# EasyEDA Pro project AFG_Health_Theremin.epro

# Schematic ProPrj_Frequency Generator for Healing_2025-11-21
Board Name: ProPrj_Frequency Generator for Healing_2025-11-21; Create Date: 2025-11-25; Page Name: ProPrj_Frequency Generator for Healing_2025-11-21; Project Name: Frequency Generator for Healing; Schematic Name: ProPrj_Frequency Generator for Healing_2025-11-21; Update Date: 2025-12-27; File: ProPrj_Frequency Generator for Healing_2025-11-21; Id: /; Sheet: /
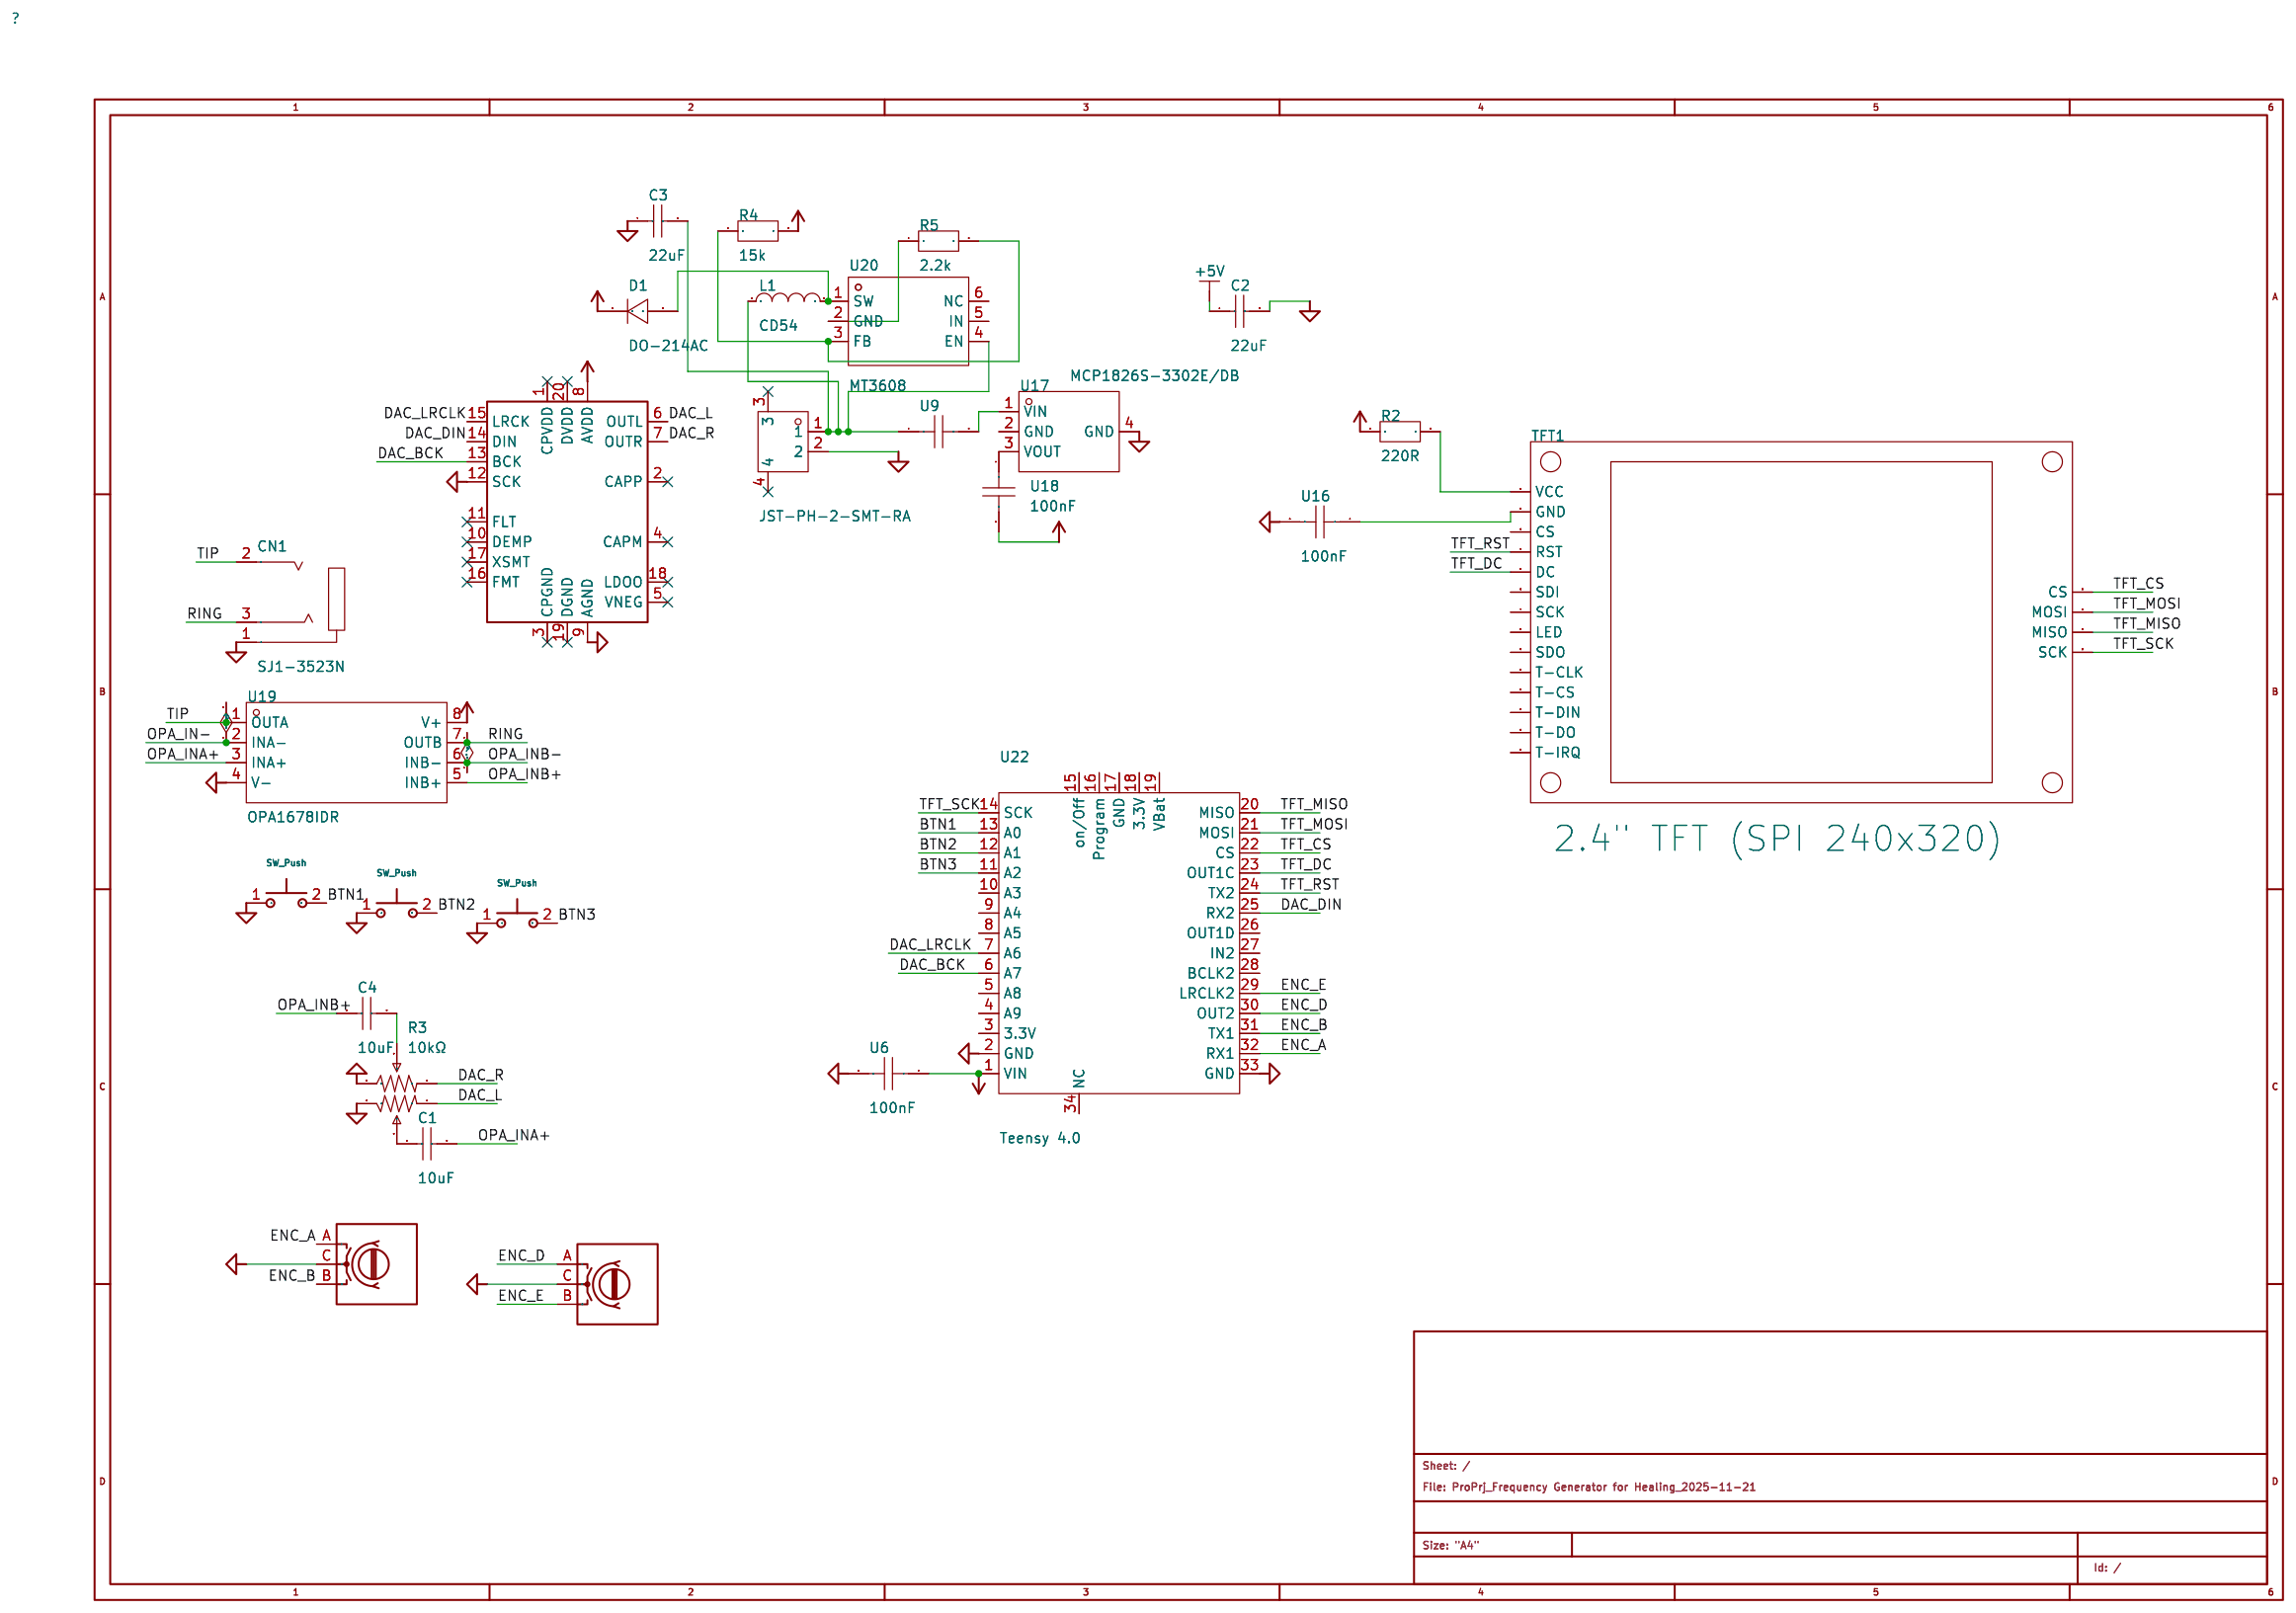
[diagram p0: schematic sheet]

## Parts
C1  10uF  [C1206]
C2  22uF  [C1206]
C3  22uF  [C1206]
C4  10uF  [C1206]
CN1  SJ1-3523N  [AUDIO-TH_SJ1-3523N]
CN2  JST-PH-2-SMT-RA  [CONN-SMD_JST-PH-2-SMT-RA]
D1  DO-214AC  [SMA_L4.3-W2.6-LS5.2-RD]
L1  CD54  [IND-SMD_L5.8-W5.2_CD54-4R7MT]
R2  220R  [R0603]
R3  10kΩ  [RES-ADJ-TH_RK097221005C]
R4  15k  [R0603]
R5  2.2k  [R0603]
SW1  EC110104S2A-VA1-006  [EC11-TH_EC110104S2A-VA1-006]
SW2  SW_Push  [SW-TH_4P-L7.2-W7.2-P4.50-S6.5_TC-02]
SW3  SW_Push  [SW-TH_4P-L7.2-W7.2-P4.50-S6.5_TC-02]
SW4  SW_Push  [SW-TH_4P-L7.2-W7.2-P4.50-S6.5_TC-02]
SW5  EC110104S2A-VA1-006  [EC11-TH_EC110104S2A-VA1-006]
TFT1  2.4" TFT (SPI 240x320)  [2.4_TFT_SPI_240x320]
U1  PCM5102APWR  [TSSOP-20_L6.5-W4.4-P0.65-LS6.4-BL]
U6  100nF  [C0603]
U9  C0603  [C0603]
U16  100nF  [C0603]
U17  MCP1826S-3302E/DB  [SOT-223-3_L6.7-W3.7-P2.30-LS7.0-BR]
U18  100nF  [C0603]
U19  OPA1678IDR  [SOIC-8_L5.0-W4.0-P1.27-LS6.0-BL]
U20  MT3608  [SOT-23-6_L2.9-W1.6-P0.95-LS2.8-BL]
U22  Teensy 4.0  [COMM-TH_34P-L35.6-W17.8-P2.54_C9900133251]

## Library data of the parts
C1-C4 = CL31A107MQHNNNE: Capacitance:100uF Tolerance:±20% Tolerance:±20% Voltage Rating:6.3V Temperature Coefficient:X5R; LCSC Part Name: 100uF ±20% 6.3V; Supplier Part: C15008; Manufacturer: SAMSUNG(三星); Supplier Footprint: 1206; JLCPCB Part Class: Basic Part; Datasheet: https://item.szlcsc.com/datasheet/CL31A107MQHNNNE/15681.html; Supplier: LCSC; Tolerance: ±20%; Voltage Rating: 6.3V; Temperature Coefficient: X5R
CN1 = SJ1-3523N: Supplier Part: C20182914; Manufacturer: CUI; JLCPCB Part Class: Extended Part; Datasheet: https://item.szlcsc.com/datasheet/SJ1-3523N/21508910.html; Supplier: LCSC
CN2 = JST-PH-2-SMT-RA: Supplier Part: C9900144926; Supplier Footprint: SMD; Supplier: LCSC
D1 = DO-214AC: Supplier Part: C9900026895; Supplier Footprint: SMA; JLCPCB Part Class: Extended Part; Supplier: LCSC
L1 = CD54: Supplier Part: C9900016766; JLCPCB Part Class: Extended Part; Supplier: LCSC
R2 R4 R5 = 1k: Supplier Part: C9900012840; JLCPCB Part Class: Extended Part; Supplier: LCSC
R3 = RK097221005C_1: Resistance:10kΩ Tolerance:±20% Tolerance:±20% Voltage Rating:- Power(Watts):- Number of Turns:-; LCSC Part Name: 10kΩ ±20%; Supplier Part: C470738; Manufacturer: ALPSALPINE(阿尔卑斯阿尔派); Manufacturer Part: RK097221005C; Supplier Footprint: 插件; Datasheet: https://atta.szlcsc.com/upload/public/pdf/source/20191216/C470759_F66FBF10924BEA4EB5A6234955541DDE.pdf; Supplier: LCSC; Tolerance: ±20%
SW1 SW5 = EC110104S2A-VA1-006: Supplier Part: C9900140894; Supplier Footprint: 无标准封装规格 EC11; Supplier: LCSC
SW2-SW4 = Switch_SW_Push: Push button switch, generic, two pins
TFT1 = 2.4_TFT_SPI_240x320
U1 = PCM5102APWR: Interface Type:PCM Supply Voltage:1.65V~3.46V Supply Voltage:1.65V~3.46V Number of Channels:2 Resolution:24；16；32 Operating Temperature:-25℃~+85℃ Operating Temperature:-25℃~+85℃; Supplier Part: C107671; Manufacturer: TI(德州仪器); Supplier Footprint: TSSOP-20; JLCPCB Part Class: Extended Part; Datasheet: https://www.ti.com/cn/lit/gpn/pcm5102a; Supplier: LCSC; Interface Type: PCM; Supply Voltage: 1.65V~3.46V; Number of Channels: 2; Resolution: 24；16；32; Operating Temperature: -25℃~+85℃
U6 U16 U18 = CT41G-0603-2X1-50V-0.1uF-K(N): Capacitance:100nF Tolerance:±10% Tolerance:±10% Voltage Rating:50V Temperature Coefficient:-; LCSC Part Name: 100nF ±10% 50V; Supplier Part: C125205; Manufacturer: TORCH(火炬); Supplier Footprint: 0603; JLCPCB Part Class: Extended Part; Datasheet: https://item.szlcsc.com/datasheet/CT41G-0603-2X1-50V-0.1uF-K(N)/136481.html; Supplier: LCSC; Tolerance: ±10%; Voltage Rating: 50V
U9 = C0603: Supplier Part: C9900029884; JLCPCB Part Class: Extended Part; Supplier: LCSC
U17 = MCP1826S-3302E/DB: Output Type:Fixed Voltage - Supply:6V Output Voltage:3.3V Output Voltage:3.3V Output Current:1A Power Supply Rejection Ratio (PSRR):60dB@(100Hz) Voltage Dropout:400mV@(1A) standby current:220uA Features:Short Circuit Protection；Over Temperature Protection; LCSC Part Name: 1000 mA，低压、低静态电流LDO稳压器; Supplier Part: C638624; Manufacturer: MICROCHIP(美国微芯); Supplier Footprint: SOT-223-3; JLCPCB Part Class: Extended Part; Datasheet: https://item.szlcsc.com/datasheet/MCP1826S-3302E%252FDB/668418.html; Supplier: LCSC; Output Type: Fixed; Voltage - Supply: 6V; Output Voltage: 3.3V; Output Current: 1A; Power Supply Rejection Ratio (PSRR): 60dB@(100Hz); Voltage Dropout: 400mV@(1A); standby current: 220uA; Features: Short Circuit Protection；Over Temperature Protection；Over Current Protection；Under Voltage Lockout; Operating Temperature: -40℃~+125℃; Output Configuration: Positive; Number of Outputs: 1
U19 = OPA1678IDR: LCSC Part Name: OPA167x 低失真音频运算放大器; Supplier Part: C192421; Manufacturer: TI(德州仪器); Supplier Footprint: SOIC-8-150mil; JLCPCB Part Class: Extended Part; Datasheet: https://www.ti.com/cn/lit/gpn/opa1678; Supplier: LCSC
U20 = MT3608: Function:Boost Output Type:Adjustable Voltage - Supply:2V~24V Voltage - Supply:2V~24V Output Voltage:- Output Voltage:- Output Current:2A Frequency - Switching:1.2MHz Frequency - Switching:1.2MHz Operating Temperature:-40℃~+85℃ Operating Temperature:-40℃~; LCSC Part Name: 老版本 高效1.2MHz 2A升压转换器; Supplier Part: C84817; Manufacturer: 西安航天民芯; Supplier Footprint: SOT-23-6; JLCPCB Part Class: Extended Part; Datasheet: https://item.szlcsc.com/datasheet/MT3608/85988.html; Supplier: LCSC; Function: Boost; Output Type: Adjustable; Voltage - Supply: 2V~24V; Output Current: 2A; Frequency - Switching: 1.2MHz; Operating Temperature: -40℃~+85℃; Synchronous Rectifier: No; Number of Outputs: 1; Topology: Boost; Quiescent Current: 100uA；1.6mA; Switch tube (built-in/external): Built-in
U22 = Teensy 4.0: Supplier Part: C9900133251; Supplier Footprint: Through hole; JLCPCB Part Class: Extended Part; Supplier: LCSC

## Nets
+5V: C2.1
BTN1: SW2.2 U22.13(A0)
BTN2: SW3.2 U22.12(A1)
BTN3: SW4.2 U22.11(A2)
DAC_BCK: U1.13(BCK) U22.6(A7)
DAC_DIN: U1.14(DIN) U22.25(RX2)
DAC_L: R3.1 U1.6(OUTL)
DAC_LRCLK: U1.15(LRCK) U22.7(A6)
DAC_R: R3.4 U1.7(OUTR)
ENC_A: SW1.A U22.32(RX1)
ENC_B: SW1.B SW1.C SW5.C U22.31(TX1)
ENC_D: SW5.A U22.30(OUT2)
ENC_E: SW5.B U22.29(LRCLK2)
OPA_IN-: CN1.2 U19.1(OUTA) U19.2(INA-)
OPA_INA+: C1.2 U19.3(INA+)
OPA_INB+: C4.1 U19.5(INB+)
OPA_INB-: CN1.3 U19.6(INB-) U19.7(OUTB)
POWER_+5V: D1.1 R2.1 R4.2 U1.8(AVDD) U6.1 U18.2 U19.8(V+) U22.1(VIN)
POWER_GND: C2.2 C3.1 CN1.1 CN2.2 R3.3 R3.6 SW2.1 SW3.1 SW4.1 U1.9(AGND) U1.12(SCK) U6.2 U16.2 U17.4(GND) U19.4(V-) U22.2(GND) U22.33(GND)
TFT_CS: TFT1.15(CS) U22.22(CS)
TFT_DC: TFT1.5(DC) U22.23(OUT1C)
TFT_MISO: TFT1.17(MISO) U22.20(MISO)
TFT_MOSI: TFT1.16(MOSI) U22.21(MOSI)
TFT_RST: TFT1.4(RST) U22.24(TX2)
TFT_SCK: TFT1.18(SCK) U22.14(SCK)
$1N10167: R2.2 TFT1.1(VCC)
$1N10228: TFT1.2(GND) U16.1
$1N11020: U9.2 U17.1(VIN)
$1N11024: C3.2 CN2.1 L1.1 U9.1 U20.4(EN)
$1N11157: U17.3(VOUT) U18.1
$1N12872: D1.2 L1.2 U20.1(SW)
$1N13027: R4.1 R5.2 U20.3(FB)
$1N13199: C1.1 R3.2
$1N13278: R5.1 U20.2(GND)
$1N13723: C4.2 R3.5

Not connected (* = marked no-connect by the designer): CN2 3* 4*; TFT1 3(CS) 6(SDI) 7(SCK) 8(LED) 9(SDO) 10(T-CLK) 11(T-CS) 12(T-DIN) 13(T-DO) 14(T-IRQ); U1 1(CPVDD)* 2(CAPP)* 3(CPGND)* 4(CAPM)* 5(VNEG)* 10(DEMP)* 11(FLT)* 16(FMT)* 17(XSMT)* 18(LDOO)* 19(DGND)* 20(DVDD)*; U17 2(GND); U20 5(IN) 6(NC); U22 3(3.3V) 4(A9) 5(A8) 8(A5) 9(A4) 10(A3) 15(on/Off) 16(Program) 17(GND) 18(3.3V) 19(VBat) 26(OUT1D) 27(IN2) 28(BCLK2) 34(NC)

# Board PCB2
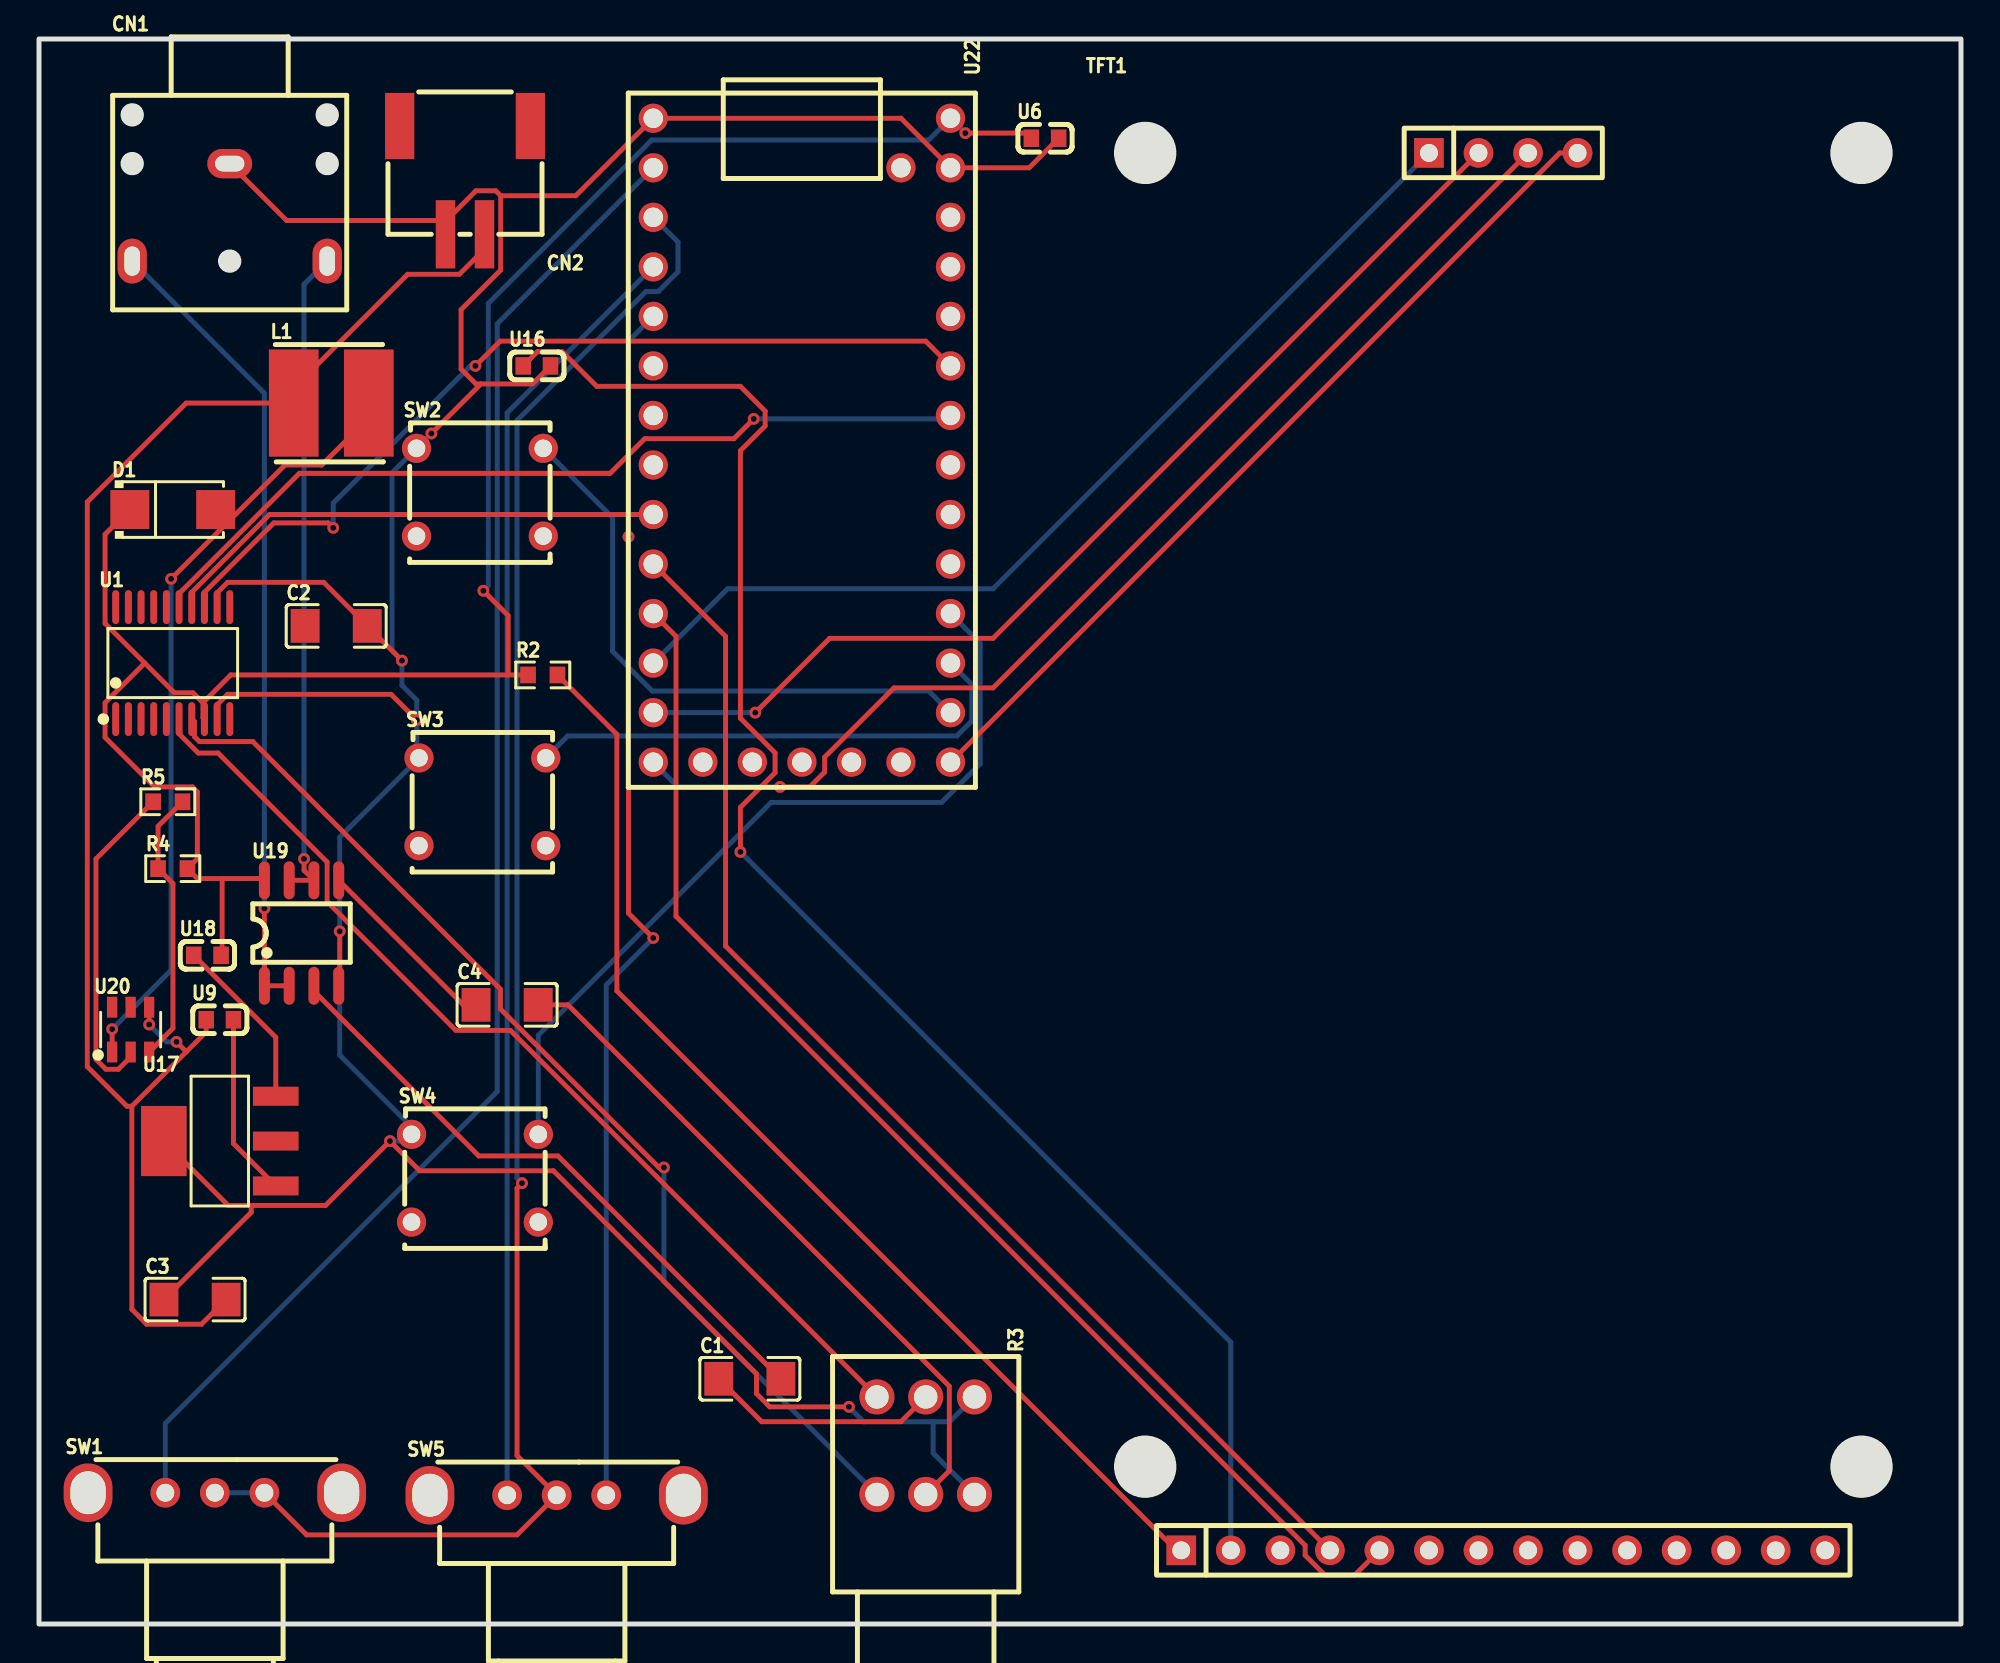
[diagram p1: board, top side]
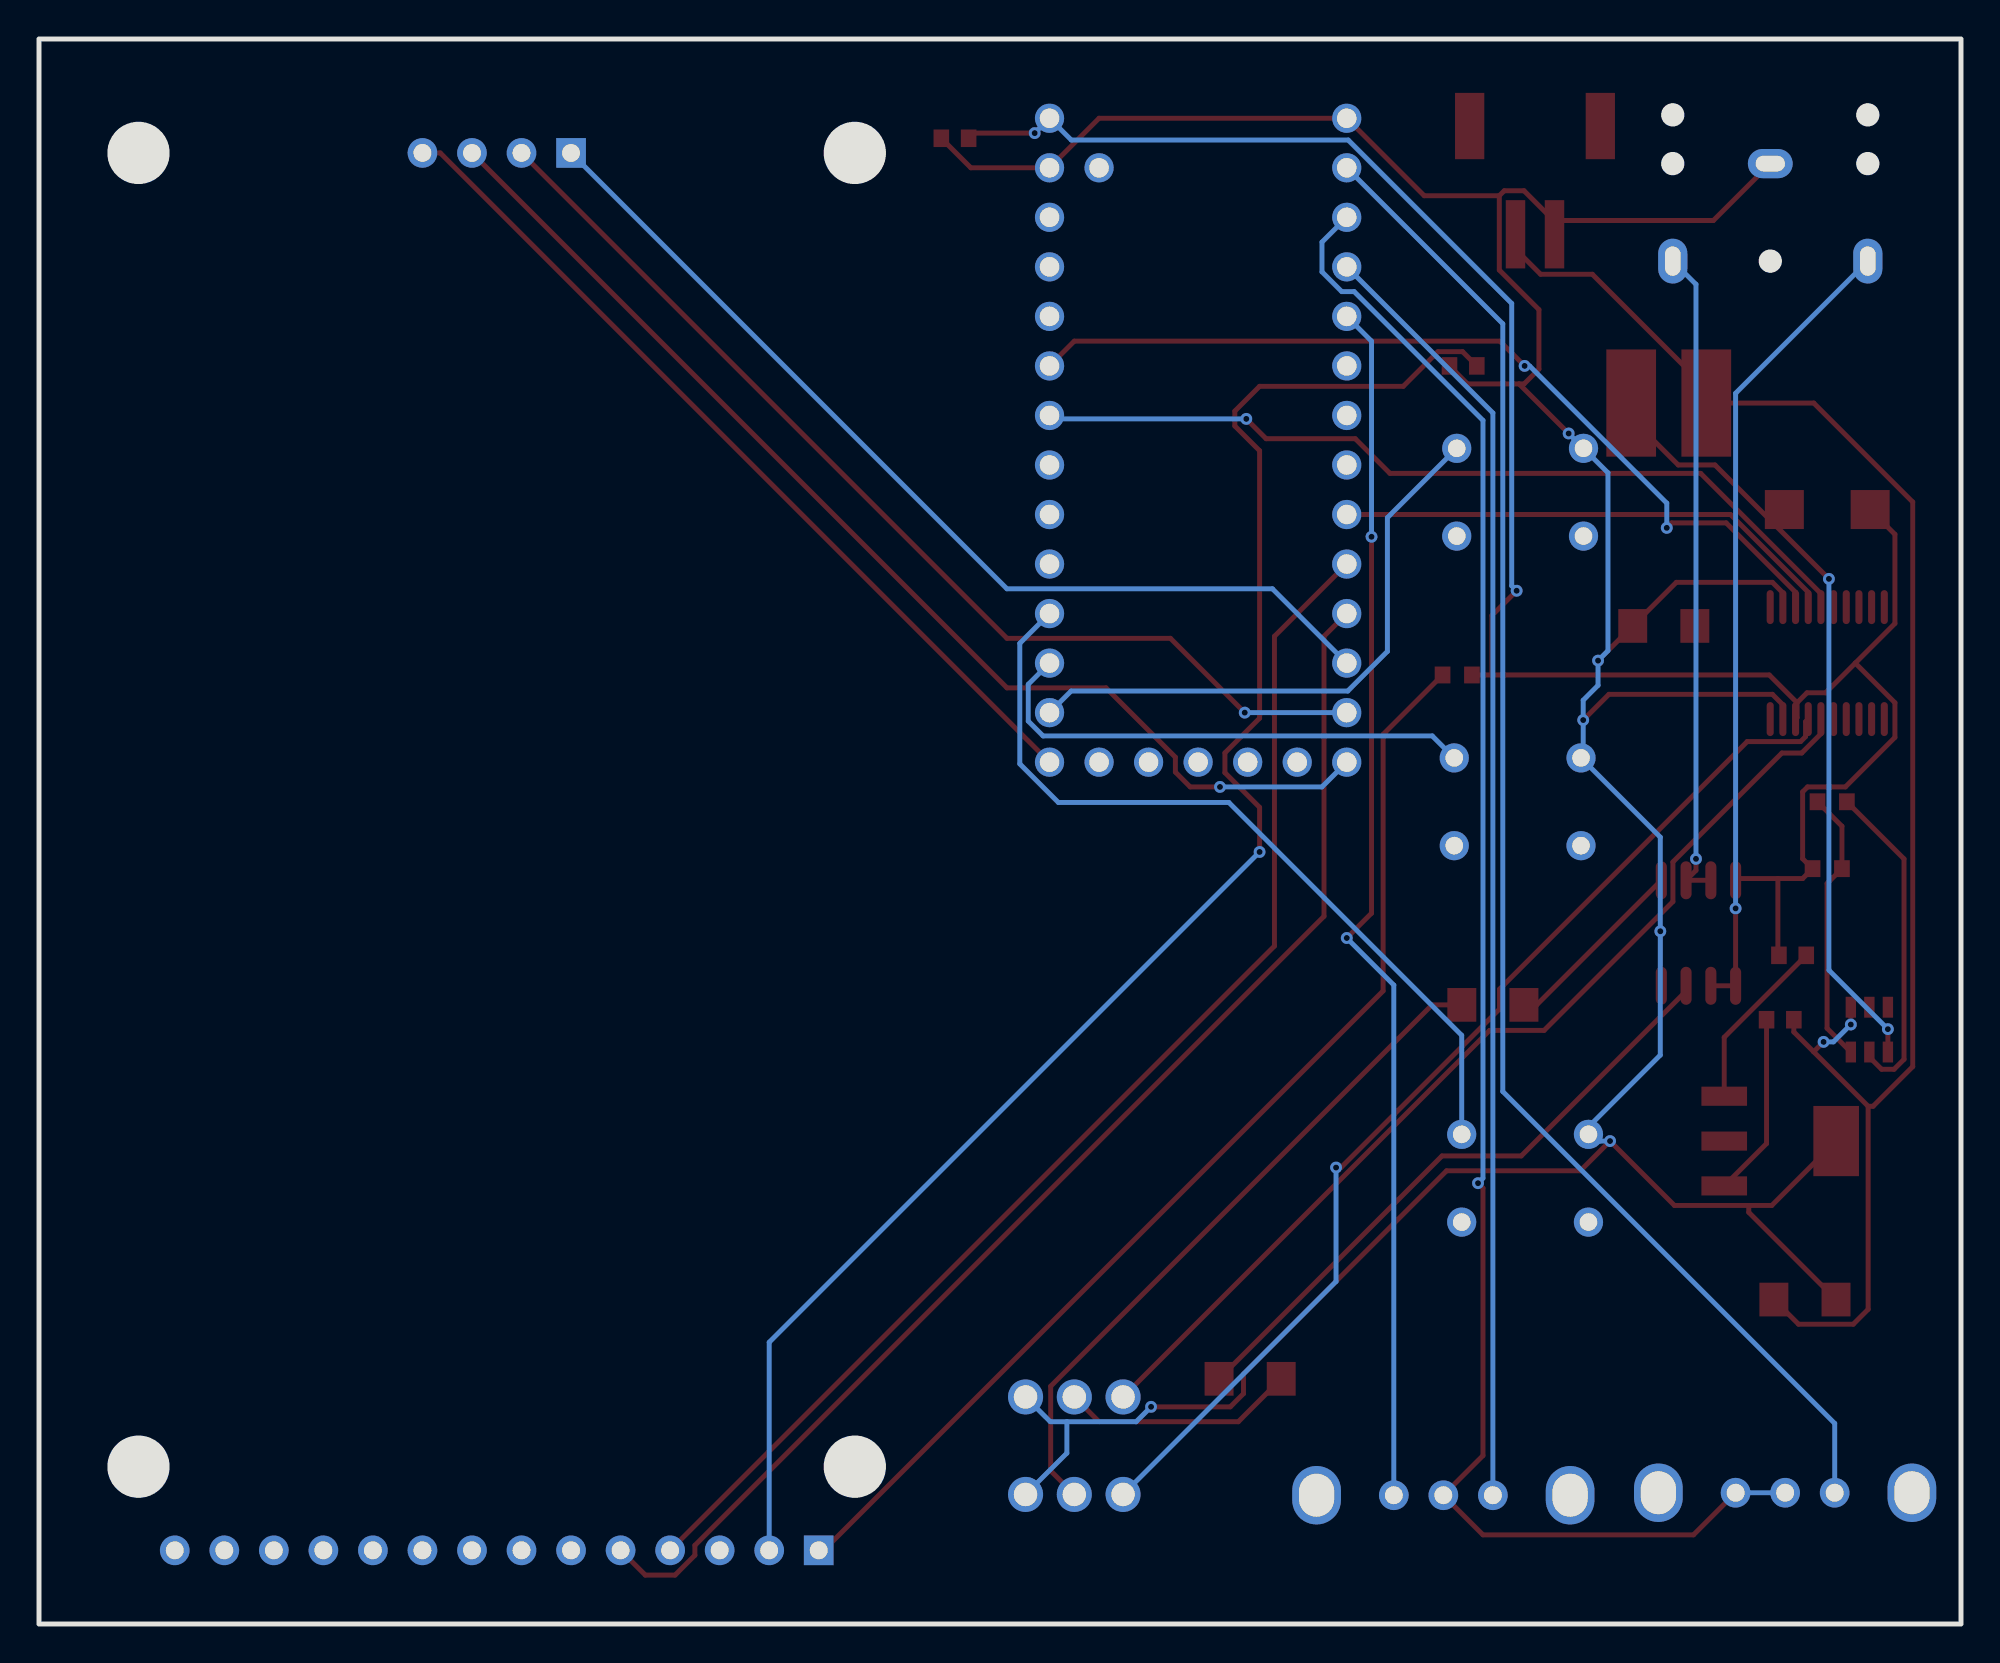
[diagram p2: board, bottom side, seen from below]

Outline 98.55 x 81.28 mm; copper layers: Top Layer, Bottom Layer. Coordinates in mm from the lower left corner of the outline.
Outline path: rectangle 0,81.28 98.55,0
Stack: Top Layer 0.035mm / Dielectric1 1.51mm FR4 er 4.5 / Bottom Layer 0.035mm

## Design rules (mm)
template: JLCPCB Capability(Two Layers Board)
spacing copperThickness1oz (default): track to track 0.102, other pairs 0.152 to 0.3
spacing copperThickness2oz: track to track 0.203, other pairs 0.152 to 0.3
track width copperThickness1oz (default): min 0.127, default 0.254, max 2.54
track width copperThickness2oz: min 0.203, default 0.254, max 2.54
differential pair differentialPair (default): width min 0.127, default 0.254, max 2.54; gap min 0.152, default 0.152
via viaSize (default): diameter min 0.5, default 0.61, max 10; hole min 0.3, default 0.305, max 6.3

## Placement (name value [footprint] x y rotation side)
C1  10uF  [C1206]  36.45 12.57 0 top
C2  22uF  [C1206]  15.24 51.18 0 top
C3  22uF  [C1206]  8 16.64 0 top
C4  10uF  [C1206]  24 31.75 0 top
CN1  SJ1-3523N  [AUDIO-TH_SJ1-3523N]  9.78 72.39 0 top
CN2  JST-PH-2-SMT-RA  [CONN-SMD_JST-PH-2-SMT-RA]  21.84 74.04 180 top
D1  DO-214AC  [SMA_L4.3-W2.6-LS5.2-RD]  6.86 57.15 0 top
L1  CD54  [IND-SMD_L5.8-W5.2_CD54-4R7MT]  14.99 62.61 0 top
R2  220R  [R0603]  25.83 48.67 0 top
R3  10kΩ  [RES-ADJ-TH_RK097221005C]  45.47 9.14 270 top
R4  15k  [R0603]  6.86 38.74 0 top
R5  2.2k  [R0603]  6.6 42.16 0 top
SW1  EC110104S2A-VA1-006  [EC11-TH_EC110104S2A-VA1-006]  9.02 6.73 0 top
SW2  SW_Push  [SW-TH_4P-L7.2-W7.2-P4.50-S6.5_TC-02]  22.61 58.04 0 top
SW3  SW_Push  [SW-TH_4P-L7.2-W7.2-P4.50-S6.5_TC-02]  22.73 42.16 0 top
SW4  SW_Push  [SW-TH_4P-L7.2-W7.2-P4.50-S6.5_TC-02]  22.35 22.86 0 top
SW5  EC110104S2A-VA1-006  [EC11-TH_EC110104S2A-VA1-006]  26.54 6.6 0 top
TFT1  2.4" TFT (SPI 240x320)  [2.4_TFT_SPI_240x320]  53.72 1.78 0 top
U1  PCM5102APWR  [TSSOP-20_L6.5-W4.4-P0.65-LS6.4-BL]  6.86 49.28 0 top
U6  100nF  [C0603]  51.58 76.19 0 top
U9  -  [C0603]  9.27 30.99 0 top
U16  100nF  [C0603]  25.53 64.52 0 top
U17  MCP1826S-3302E/DB  [SOT-223-3_L6.7-W3.7-P2.30-LS7.0-BR]  9.27 24.77 0 top
U18  100nF  [C0603]  8.64 34.29 0 top
U19  OPA1678IDR  [SOIC-8_L5.0-W4.0-P1.27-LS6.0-BL]  13.46 35.43 0 top
U20  MT3608  [SOT-23-6_L2.9-W1.6-P0.95-LS2.8-BL]  4.7 30.48 0 top
U22  Teensy 4.0  [COMM-TH_34P-L35.6-W17.8-P2.54_C9900133251]  39.12 60.71 270 top

## Footprints (pads in the part's own frame, mm; a bottom-side part is the same pattern mirrored in y, then rotated)
2.4_TFT_SPI_240x320
  rect 1.524x1.524 hole 0.914: 1(4.85,2) 15(17.55,73.66)
  round 1.524 hole 0.914: 2(7.39,2) 3(9.93,2) 4(12.47,2) 5(15.01,2) 6(17.55,2) 7(20.09,2) 8(22.63,2) 9(25.17,2) 10(27.71,2) 11(30.25,2) 12(32.79,2) 13(35.33,2) 14(37.87,2) 16(20.09,73.66) 17(22.63,73.66) 18(25.17,73.66)
AUDIO-TH_SJ1-3523N
  oval 2.3x1.5 hole 1.5x0.8: 1(0,2.5)
  oval 1.5x2.3 hole 0.8x1.5: 2(-5,-2.5) 3(5,-2.5)
C0603
  rect 0.8x0.9 smd: 1(-0.7,0) 2(0.7,0)
C1206
  rect 1.485x1.728 smd: 1(-1.593,0) 2(1.593,0)
COMM-TH_34P-L35.6-W17.8-P2.54_C9900133251
  round 1.5 hole 1: 1(-16.51,7.62) 2(-13.97,7.62) 3(-11.43,7.62) 4(-8.89,7.62) 5(-6.35,7.62) 6(-3.81,7.62) 7(-1.27,7.62) 8(1.27,7.62) 9(3.81,7.62) 10(6.35,7.62) 11(8.89,7.62) 12(11.43,7.62) 13(13.97,7.62) 14(16.51,7.62) 15(16.51,5.08) 16(16.51,2.54) 17(16.51,0) 18(16.51,-2.54) 19(16.51,-5.08) 20(16.51,-7.62) 21(13.97,-7.62) 22(11.43,-7.62) 23(8.89,-7.62) 24(6.35,-7.62) 25(3.81,-7.62) 26(1.27,-7.62) 27(-1.27,-7.62) 28(-3.81,-7.62) 29(-6.35,-7.62) 30(-8.89,-7.62) 31(-11.43,-7.62) 32(-13.97,-7.62) 33(-16.51,-7.62) 34(-13.97,5.08)
CONN-SMD_JST-PH-2-SMT-RA
  rect 1x3.5 smd: 1(-1,2.775) 2(1,2.775)
  rect 1.5x3.4 smd: 3(-3.35,-2.775) 4(3.35,-2.775)
EC11-TH_EC110104S2A-VA1-006
  oval 2.5x3 hole 1.8x2.2: 4(6.5,0) 5(-6.5,0)
  round 1.524 hole 0.914: A(-2.54,0) B(2.54,0) C(0,0)
IND-SMD_L5.8-W5.2_CD54-4R7MT
  rect 2.55x5.5 smd: 1(-1.925,0) 2(1.925,0)
R0603
  rect 0.806x0.864 smd: 1(-0.753,0) 2(0.753,0)
RES-ADJ-TH_RK097221005C
  round 1.8 hole 1.2: 1(-2.5,-2.5) 2(-2.5,0) 3(-2.5,2.5) 4(2.5,-2.5) 5(2.5,0) 6(2.5,2.5)
SMA_L4.3-W2.6-LS5.2-RD
  rect 2x2 smd: 1(-2.2,0) 2(2.2,0)
SOIC-8_L5.0-W4.0-P1.27-LS6.0-BL
  oval 0.569x1.95 smd: 1(-1.905,-2.705) 2(-0.635,-2.705) 3(0.635,-2.705) 4(1.905,-2.705) 5(1.905,2.705) 6(0.635,2.705) 7(-0.635,2.705) 8(-1.905,2.705)
SOT-23-6_L2.9-W1.6-P0.95-LS2.8-BL
  rect 0.532x1.072 smd: 1(-0.95,-1.149) 2(0,-1.149) 3(0.95,-1.149) 4(0.95,1.149) 5(0,1.149) 6(-0.95,1.149)
SOT-223-3_L6.7-W3.7-P2.30-LS7.0-BR
  rect 2.34x0.98 smd: 1(2.87,-2.3) 2(2.87,0) 3(2.87,2.3)
  rect 2.34x3.6 smd: 4(-2.87,0)
SW-TH_4P-L7.2-W7.2-P4.50-S6.5_TC-02
  round 1.5 hole 0.9: 1(-3.25,2.25) 2(3.25,2.25) 3(-3.25,-2.25) 4(3.25,-2.25)
TSSOP-20_L6.5-W4.4-P0.65-LS6.4-BL
  oval 0.364x1.742 smd: 1(-2.925,-2.871) 2(-2.275,-2.871) 3(-1.625,-2.871) 4(-0.975,-2.871) 5(-0.325,-2.871) 6(0.325,-2.871) 7(0.975,-2.871) 8(1.625,-2.871) 9(2.275,-2.871) 10(2.925,-2.871) 11(2.925,2.871) 12(2.275,2.871) 13(1.625,2.871) 14(0.975,2.871) 15(0.325,2.871) 16(-0.325,2.871) 17(-0.975,2.871) 18(-1.625,2.871) 19(-2.275,2.871) 20(-2.925,2.871)

## Nets
As in the schematic.

Pads without a net: CN2 3 4; SW1 4 5; SW2 3 4; SW3 3 4; SW4 3 4; SW5 4 5; TFT1 3 6 7 8 9 10 11 12 13 14; U1 1 2 3 4 5 10 11 16 17 18 19 20; U17 2; U20 5 6; U22 3 4 5 8 9 10 15 16 17 18 19 26 27 28 34

## Via types
v1: diameter 0.61, hole 0.305, Top Layer to Bottom Layer, 24 vias

## Routing (per net, layer and track width the routed paths; a pad name or vN(x,y) marks a point on that pad's centre or on a via; arc(x,y) is an arc through that point)
BTN1: length 30.5
  Bottom Layer w0.254: U22.13 45.63,47.84 31.44,47.84 29.41,49.88 29.41,56.73 SW2.2
BTN2: length 26.1
  Bottom Layer w0.254: SW3.2 27.11,45.54 47.07,45.54 47.83,46.3 47.83,48.19 U22.12
BTN3: length 41.8
  Bottom Layer w0.254: U22.11 48.26,50.29 48.26,44.11 46.28,42.13 37.54,42.13 25.6,30.19 SW4.2
DAC_BCK: length 45.8
  Top Layer w0.254: U22.6 45.47,65.79 23.65,65.79 v1(22.38,64.52) ; 8.48,52.15 8.48,52.91 12.04,56.47 14.83,56.47 v1(15.09,56.21)
  Bottom Layer w0.254: v1(15.09,56.21) 15.09,57.48 22.12,64.52 v1(22.38,64.52)
DAC_DIN: length 26.1
  Top Layer w0.254: 7.83,52.15 7.83,52.91 11.82,56.9 U22.25
DAC_L: length 51.8
  Top Layer w0.254: R3.1 24.17,30.44 21.38,30.44 14.77,37.04 14.77,39.08 9.18,44.66 8.17,44.66 7.18,45.65 U1.6
DAC_LRCLK: length 44
  Top Layer w0.254: 7.18,52.15 7.18,52.84 13.35,59.01 29.28,59.01 31.06,60.78 35.63,60.78 v1(36.65,61.8)
  Bottom Layer w0.254: U22.7 46.56,61.8 v1(36.65,61.8)
DAC_R: length 56.1
  Top Layer w0.254: v1(32.04,23.41) 31.79,23.41 23.66,31.54 23.66,32.55 10.96,45.25 8.22,45.25 7.97,45.51 7.97,46.27 U1.7
  Bottom Layer w0.254: v1(32.04,23.41) 32.04,17.57 R3.4
ENC_A: length 78.3
  Bottom Layer w0.254: SW1.A 6.48,10.29 23.5,27.31 23.5,66.68 U22.32
ENC_B: length 90.2
  Top Layer w0.254: SW1.B 13.72,4.57 24.51,4.57 SW5.C 24.51,8.64 24.51,22.35 v1(24.77,22.61)
  Bottom Layer w0.254: SW1.B SW1.C ; v1(24.77,22.61) 24.51,22.86 24.51,61.72 31.11,68.33 31.75,68.33 32.77,69.34 32.77,70.87 U22.31
ENC_D: length 66.1
  Bottom Layer w0.254: SW5.A 24,62.1 U22.30
ENC_E: length 62.5
  Top Layer w0.254: v1(31.5,35.18) 30.23,36.45 v1(30.23,55.75)
  Bottom Layer w0.254: 29.08,6.6 29.08,32.77 v1(31.5,35.18) ; U22.29 30.23,65.79 v1(30.23,55.75)
OPA_IN-: length 41.2
  Top Layer w0.254: v1(11.56,36.7) U19.1 U19.2
  Bottom Layer w0.254: v1(11.56,36.7) 11.56,63.11 CN1.2
OPA_INA+: length 32.5
  Top Layer w0.254: C1.2 26.61,24 22.55,24 14.1,32.45 U19.3
OPA_INB+: length 9.7
  Top Layer w0.254: U19.5 21.76,31.75 C4.1
OPA_INB-: length 33.7
  Top Layer w0.254: U19.7 U19.6 13.59,38.65 v1(13.59,39.24)
  Bottom Layer w0.254: v1(13.59,39.24) 13.59,68.7 CN1.3
POWER_+5V: length 105.9
  Top Layer w0.254: U18.2 9.39,34.34 9.39,38.23 ; 9.39,38.23 8.12,38.23 R4.2 8.12,39.24 8.12,42.67 7.87,42.93 5.93,42.93 3.39,45.47 3.39,47.24 5.42,49.28 ; 9.39,38.23 11.47,38.23 U19.8 ; U6.1 50.62,76.45 v1(47.5,76.45) ; 5.42,49.28 6.94,47.75 7.9,47.75 8.41,47.24 ; 5.42,49.28 3.39,51.31 3.39,55.88 D1.1 ; 8.41,47.24 8.41,46.48 U1.8 ; 8.41,47.24 9.83,48.67 24.05,48.67 ; 24.05,48.67 25.08,48.67 ; 24.05,48.67 24.05,51.72 v1(22.78,52.99)
  Bottom Layer w0.254: v1(47.5,76.45) U22.1 45.62,76.1 31.42,76.1 23.04,67.72 23.04,53.24 v1(22.78,52.99)
POWER_GND: length 198.2
  Top Layer w0.254: 6.4,24.77 9.7,21.46 10.88,21.46 ; 20.88,71.97 20.88,71.3 CN2.2 ; 20.88,71.97 22.4,73.5 23.42,73.5 23.67,73.24 ; 20.88,71.97 12.7,71.97 CN1.1 ; U16.2 25.3,63.59 22.66,63.59 ; C3.1 10.88,21.11 10.88,21.46 ; v1(41.53,11.14) 37.47,11.14 36.79,11.81 36.79,12.83 26.38,23.24 19.52,23.24 v1(18,24.77) 14.69,21.46 10.88,21.46 ; 22.66,63.59 22.4,63.59 21.64,64.35 21.64,67.4 23.67,69.43 23.67,73.24 ; 22.66,63.59 v1(20.12,61.05) ; 23.67,73.24 27.52,73.24 U22.33 44.2,77.22 U22.2 50.77,74.68 U6.2 ; U1.9 9.13,47.14 9.67,47.68 18.05,47.68 v1(19.37,46.36) ; v1(18.61,49.4) C2.2 14.6,53.42 9.67,53.42 9.13,52.88 9.13,52.15 ; U19.4 15.42,32.78 v1(15.42,35.52)
  Bottom Layer w0.254: v1(20.12,61.05) SW2.1 18.1,59.04 18.1,49.91 v1(18.61,49.4) 18.61,48.13 19.37,47.37 v1(19.37,46.36) 19.37,44.52 SW3.1 15.42,40.35 v1(15.42,35.52) 15.42,29.17 18.98,25.62 18.98,25.24 ; 45.85,10.37 45.85,8.76 R3.6 ; 45.85,10.37 42.29,10.37 v1(41.53,11.14) ; 45.85,10.37 46.7,10.37 R3.3 ; 18.98,25.24 18.5,24.77 v1(18,24.77) ; 18.98,25.24 SW4.1
TFT_CS: length 50.6
  Bottom Layer w0.254: 71.27,75.44 48.92,53.09 35.31,53.09 U22.22
TFT_DC: length 66.9
  Top Layer w0.254: TFT1.5 67.46,2.51 65.94,2.51 64.92,3.52 64.92,4.03 32.66,36.29 32.66,50.65 U22.23
TFT_MISO: length 59.3
  Top Layer w0.254: v1(38,42.93) 39.52,42.93 40.28,43.69 40.28,44.45 43.84,48.01 48.92,48.01 TFT1.17
  Bottom Layer w0.254: v1(38,42.93) 32.77,42.93 U22.20
TFT_MOSI: length 54.2
  Top Layer w0.254: v1(36.73,46.74) 40.54,50.55 48.92,50.55 73.81,75.44
  Bottom Layer w0.254: v1(36.73,46.74) U22.21
TFT_RST: length 64.9
  Top Layer w0.254: U22.24 35.2,50.65 35.2,34.77 TFT1.4
TFT_SCK: length 45.1
  Top Layer w0.254: 78.89,75.44 77.98,75.44 U22.14
$1N10167: length 58.3
  Top Layer w0.254: R2.2 29.63,45.62 29.63,32.46 58.32,3.78 TFT1.1
$1N10228: length 84.8
  Top Layer w0.254: U16.1 25.56,65.25 26.82,65.25 28.6,63.47 35.97,63.47 37.23,62.2 37.23,61.44 35.97,60.17 35.97,46.45 37.74,44.67 37.74,43.66 35.97,41.88 v1(35.97,39.59)
  Bottom Layer w0.254: TFT1.2 61.11,14.45 v1(35.97,39.59)
$1N11020: length 9.4
  Top Layer w0.254: U17.1 9.97,24.64 U9.2
$1N11024: length 84.5
  Top Layer w0.254: 4.76,26.55 7.56,29.34 ; 4.76,26.55 4.76,16.14 5.52,15.37 8.33,15.37 C3.2 ; 4.76,26.55 4.51,26.55 2.48,28.58 2.48,57.54 7.55,62.61 L1.1 13.06,63.37 18.9,69.22 21.56,69.22 22.83,70.49 22.83,71.25 CN2.1 ; 7.56,29.34 8.57,30.36 U9.1 ; 7.56,29.34 v1(7.05,29.85) ; v1(5.65,30.74) U20.4
  Bottom Layer w0.254: v1(7.05,29.85) 6.54,29.85 v1(5.65,30.74)
$1N11157: length 9
  Top Layer w0.254: U18.1 12.14,30.09 U17.3
$1N12872: length 40.8
  Top Layer w0.254: D1.2 9.31,57.15 9.82,56.64 ; v1(3.75,30.51) 3.75,29.33 ; L1.2 16.91,61.85 14.5,59.44 12.61,59.44 9.82,56.64 ; 9.82,56.64 v1(6.77,53.59)
  Bottom Layer w0.254: v1(3.75,30.51) 6.77,33.53 v1(6.77,53.59)
$1N13027: length 14.2
  Top Layer w0.254: R5.2 6.1,40.91 R4.1 6.87,37.97 6.87,30.55 U20.3
$1N13199: length 12
  Top Layer w0.254: R3.2 44.2,10.37 37.06,10.37 C1.1
$1N13278: length 16.9
  Top Layer w0.254: R5.1 2.92,39.23 2.92,28.96 3.43,28.45 4.07,28.45 4.7,29.08 U20.2
$1N13723: length 35.2
  Top Layer w0.254: C4.2 27.12,31.75 46.68,12.19 46.68,7.86 R3.5
